# Altium schematic sheet Item.SchDoc
size A4
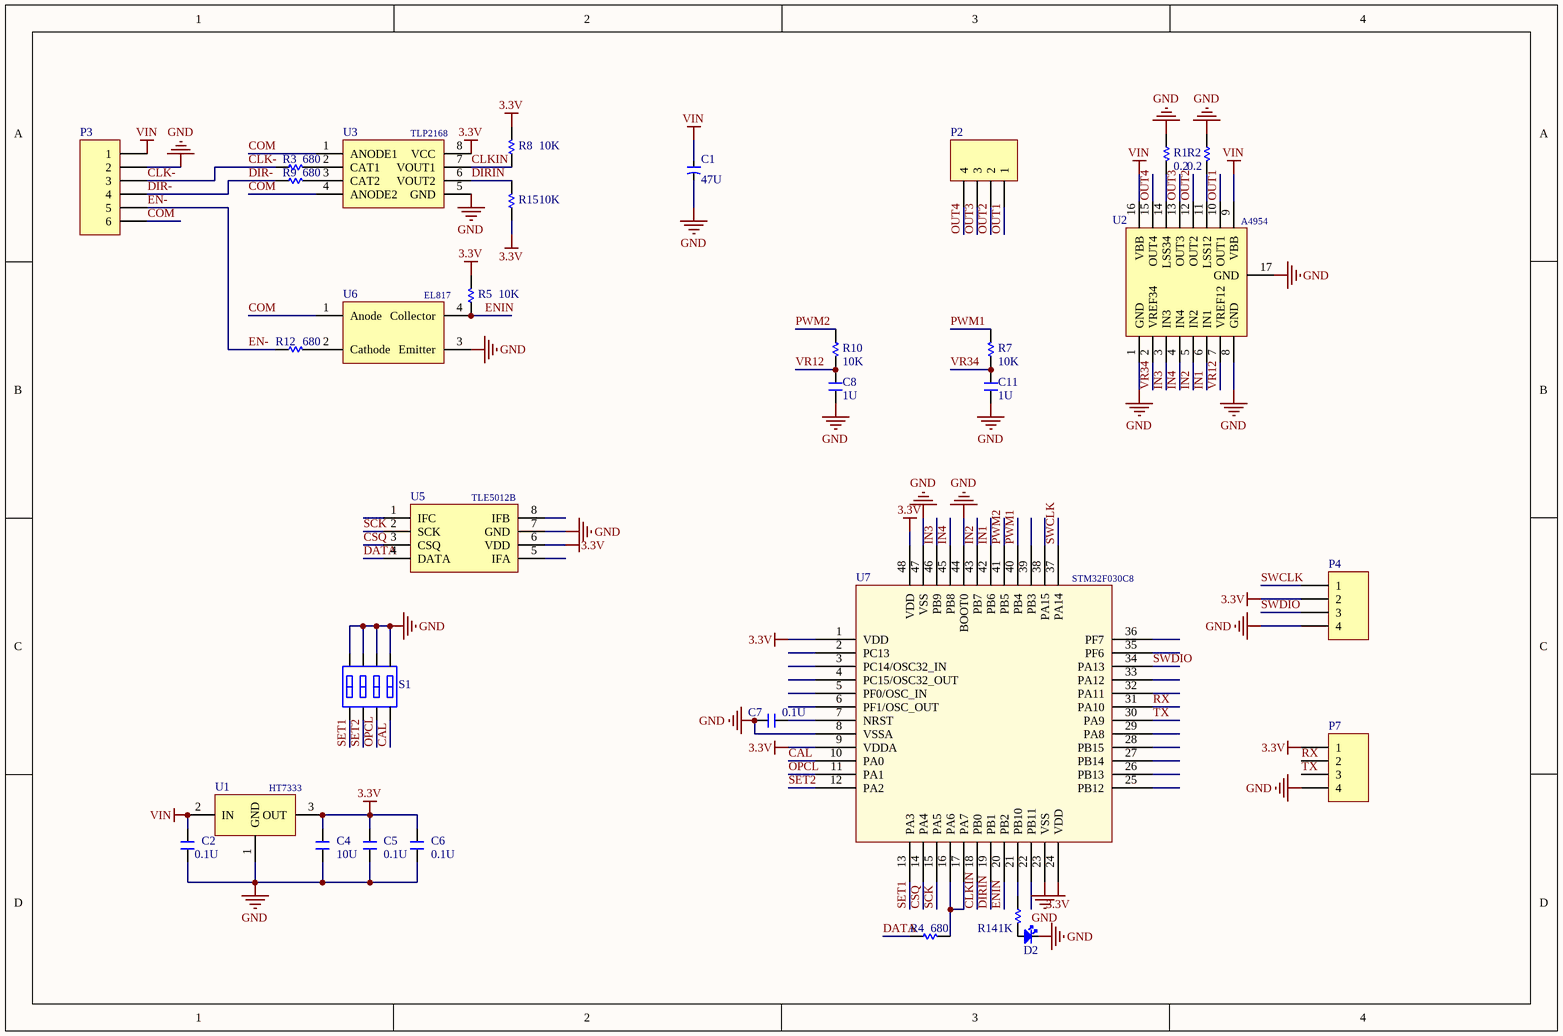
[diagram p0: Item.SchDoc]

## Parts
C1  value 47U  [CAP6377]  (hidden comment: CAP POL)
C2  value 0.1U  [0805]  (hidden comment: CAP)
C4  value 10U  [0805]  (hidden comment: CAP)
C5  value 0.1U  [0805]  (hidden comment: CAP)
C6  value 0.1U  [0805]  (hidden comment: CAP)
C7  value 0.1U  [0805]  (hidden comment: CAP)
C8  value 1U  [0805]  (hidden comment: CAP)
C11  value 1U  [0805]  (hidden comment: CAP)
D2  LED  [0805]  (value not drawn)
P2  HEADER4  [XH-4]  (value not drawn)
P3  HEADER6  [XH-6]  (value not drawn)
P4  HEADER4  [4P-1.27MM]  (value not drawn)
P7  HEADER4  [4P-1.27MM]  (value not drawn)
R1  value 0.2  [1206]  (hidden comment: RES)
R2  value 0.2  [1206]  (hidden comment: RES)
R3  value 680  [0805]  (hidden comment: RES)
R4  value 680  [0805]  (hidden comment: RES)
R5  value 10K  [0805]  (hidden comment: RES)
R7  value 10K  [0805]  (hidden comment: RES)
R8  value 10K  [0805]  (hidden comment: RES)
R9  value 680  [0805]  (hidden comment: RES)
R10  value 10K  [0805]  (hidden comment: RES)
R12  value 680  [0805]  (hidden comment: RES)
R14  value 1K  [0805]  (hidden comment: RES)
R15  value 10K  [0805]  (hidden comment: RES)
S1  SWDIP-4  [SWDIP-4]  (value not drawn)
U1  HT7333  [SOT89]
U2  A4954  [TSSOP16-A4954]
U3  TLP2168  [SO-8_3.9mm]
U5  TLE5012B  [PG-DSO-8F]
U6  EL817  [SOP-4_P2.54]
U7  STM32F030C8  [LQFP-48_7x7x05P]

## Nets
3.3V: C4.1 C5.1 C6.1 P4.2 P7.1 R5.2 R8.2 R15.1 U1.3(OUT) U3.8(VCC) U5.6(VDD) U7.1(VDD) U7.9(VDDA) U7.24(VDD) U7.48(VDD)
GND: C1.2 C2.2 C4.2 C5.2 C6.2 C7.1 C8.2 C11.2 D2.2(K) P3.2 P4.4 P7.4 R1.1 R2.1 S1.2(B1) S1.4(B2) S1.6(B3) S1.8(B4) U1.1(GND) U2.1(GND) U2.8(GND) U2.17(GND) U3.5(GND) U5.7(GND) U6.3(Emitter) U7.8(VSSA) U7.23(VSS) U7.44(BOOT0) U7.47(VSS)
VIN: C1.1 C2.1 P3.1 U1.2(IN) U2.9(VBB) U2.16(VBB)
CAL: S1.7(A4) U7.10(PA0)
CLK-: P3.3 R3.1
CLKIN: R8.1 U3.7(VOUT1) U7.18(PB0)
COM: P3.6 U3.1(ANODE1) U3.4(ANODE2) U6.1(Anode)
CSQ: U5.3(CSQ) U7.14(PA4)
DATA: R4.1 U5.4(DATA)
DIR-: P3.4 R9.1
DIRIN: R15.2 U3.6(VOUT2) U7.19(PB1)
EN-: P3.5 R12.1
ENIN: R5.1 U6.4(Collector) U7.20(PB2)
IN1: U2.6(IN1) U7.42(PB6)
IN2: U2.5(IN2) U7.43(PB7)
IN3: U2.3(IN3) U7.46(PB9)
IN4: U2.4(IN4) U7.45(PB8)
OPCL: S1.5(A3) U7.11(PA1)
OUT1: P2.1 U2.10(OUT1)
OUT2: P2.2 U2.12(OUT2)
OUT3: P2.3 U2.13(OUT3)
OUT4: P2.4 U2.15(OUT4)
PWM1: R7.2 U7.40(PB4)
PWM2: R10.1 U7.41(PB5)
RX: P7.2 U7.31(PA10)
SCK: U5.2(SCK) U7.15(PA5)
SET1: S1.1(A1) U7.13(PA3)
SET2: S1.3(A2) U7.12(PA2)
SWCLK: P4.1 U7.37(PA14)
SWDIO: P4.3 U7.34(PA13)
TX: P7.3 U7.30(PA9)
VR12: C8.1 R10.2 U2.7(VREF12)
VR34: C11.1 R7.1 U2.2(VREF34)
NetC7_2: C7.2 U7.7(NRST)
NetD2_1: D2.1(A) R14.2
NetR1_2: R1.2 U2.14(LSS34)
NetR2_2: R2.2 U2.11(LSS12)
NetR3_2: R3.2 U3.2(CAT1)
NetR4_2: R4.2 U7.16(PA6) U7.17(PA7)
NetR9_2: R9.2 U3.3(CAT2)
NetR12_2: R12.2 U6.2(Cathode)
NetR14_1: R14.1 U7.21(PB10)

Not connected (* = marked no-connect by the designer): U5 1(IFC) 5(IFA) 8(IFB); U7 2(PC13) 3(PC14/OSC32_IN) 4(PC15/OSC32_OUT) 5(PF0/OSC_IN) 6(PF1/OSC_OUT) 22(PB11) 25(PB12) 26(PB13) 27(PB14) 28(PB15) 29(PA8) 32(PA11) 33(PA12) 35(PF6) 36(PF7) 38(PA15) 39(PB3)

## Library data of the parts
C1 = CAP POL: Polarized Capacitor (Axial); Published: 8-Jun-2000; LatestRevisionDate: 17-Jul-2002; LatestRevisionNote: Re-released for DXP Platform.; PackageReference: POLAR0.8; Publisher: Altium Limited; PackageDescription: Polarized Capacitor; 2 Leads
C2 C4-C8 C11 = CAP: Capacitor; Published: 8-Jun-2000; LatestRevisionDate: 17-Jul-2002; LatestRevisionNote: Re-released for DXP Platform.; PackageReference: RAD-0.3; Publisher: Altium Limited; PackageDescription: Radial Cap, Thru-Hole; 2 Leads; 0.3 in Pin Spacing
D2 = LED: Typical INFRARED GaAs LED; Published: 8-Jun-2000; LatestRevisionDate: 08-Jul-2005; LatestRevisionNote: Mech Layer 1 removed.; PackageReference: LED-0; Publisher: Altium Limited; PackageDescription: LED; 2 Leads
P2 P4 P7 = HEADER4: Header, 4-Pin; LatestRevisionDate: 17-Jul-2002; LatestRevisionNote: Re-released for DXP Platform.; Publisher: Altium Limited
P3 = HEADER6: Header, 6-Pin; LatestRevisionDate: 17-Jul-2002; LatestRevisionNote: Re-released for DXP Platform.; Publisher: Altium Limited
R1-R5 R7-R10 R12 R14 R15 = RES: Resistor; Published: 8-Jun-2000; LatestRevisionDate: 17-Jul-2002; LatestRevisionNote: Re-released for DXP Platform.; PackageReference: AXIAL-0.3; Publisher: Altium Limited; PackageDescription: Axial Device, Thru-Hole; 2 Leads; 0.3 in Pin Spacing
S1 = SWDIP-4: DIP Switch, 4Position, SPST; Published: 24-Mar-1999; LatestRevisionDate: 17-Jul-2002; LatestRevisionNote: Re-released for DXP Platform.; PackageReference: DIP-6; Publisher: Altium Limited; Code_JEDEC: MO-001-AM
U1 = HT7333: Positive Voltage Regulator; Published: 24-Aug-2001; LatestRevisionDate: 17-Jul-2002; LatestRevisionNote: Re-released for DXP Platform.; DatasheetVersion: Feb-1999; PackageReference: TO92; Publisher: Altium Limited; PackageDescription: TO, Flat Index; 3 In-Line, Axial Leads; Body Dia. 4.8mm; Leads 0.51 x 0.51 mm (max); ComponentLink1Description: Manufacturer Link; ComponentLink1URL: http://www.st.com/
U2 = A4954: Dual Full-Bridge  DMOS PWM Motor Driver
U3 = TLP2168: HIGH SPEED 10MBit/s LOGIC GATE  PHOTOCOUPLER
U5 = TLE5012B: GMR-Based Angle Sensor
U6 = EL817: 4 PIN PHOTOTRANSISTOR
U7 = STM32F030C8: ST Microcontroller